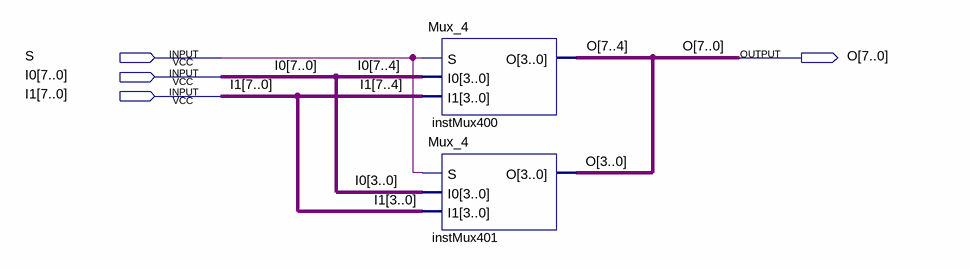
[diagram p0: schematic sheet]
// Quartus schematic Mux8Bit.bdf as structural Verilog: 2 symbols, 4 pins
module Mux8Bit (
  input  S,
  input  [7:0] I0,
  input  [7:0] I1,
  output [7:0] O
);

  Mux_4 instMux400 (.S(S), .I0(I0[7:4]), .I1(I1[7:4]), .O(O[7:4]));
  Mux_4 instMux401 (.S(S), .I0(I0[3:0]), .I1(I1[3:0]), .O(O[3:0]));
endmodule
